# EAGLE design Pixel-2 (EAGLE 8.3.2)
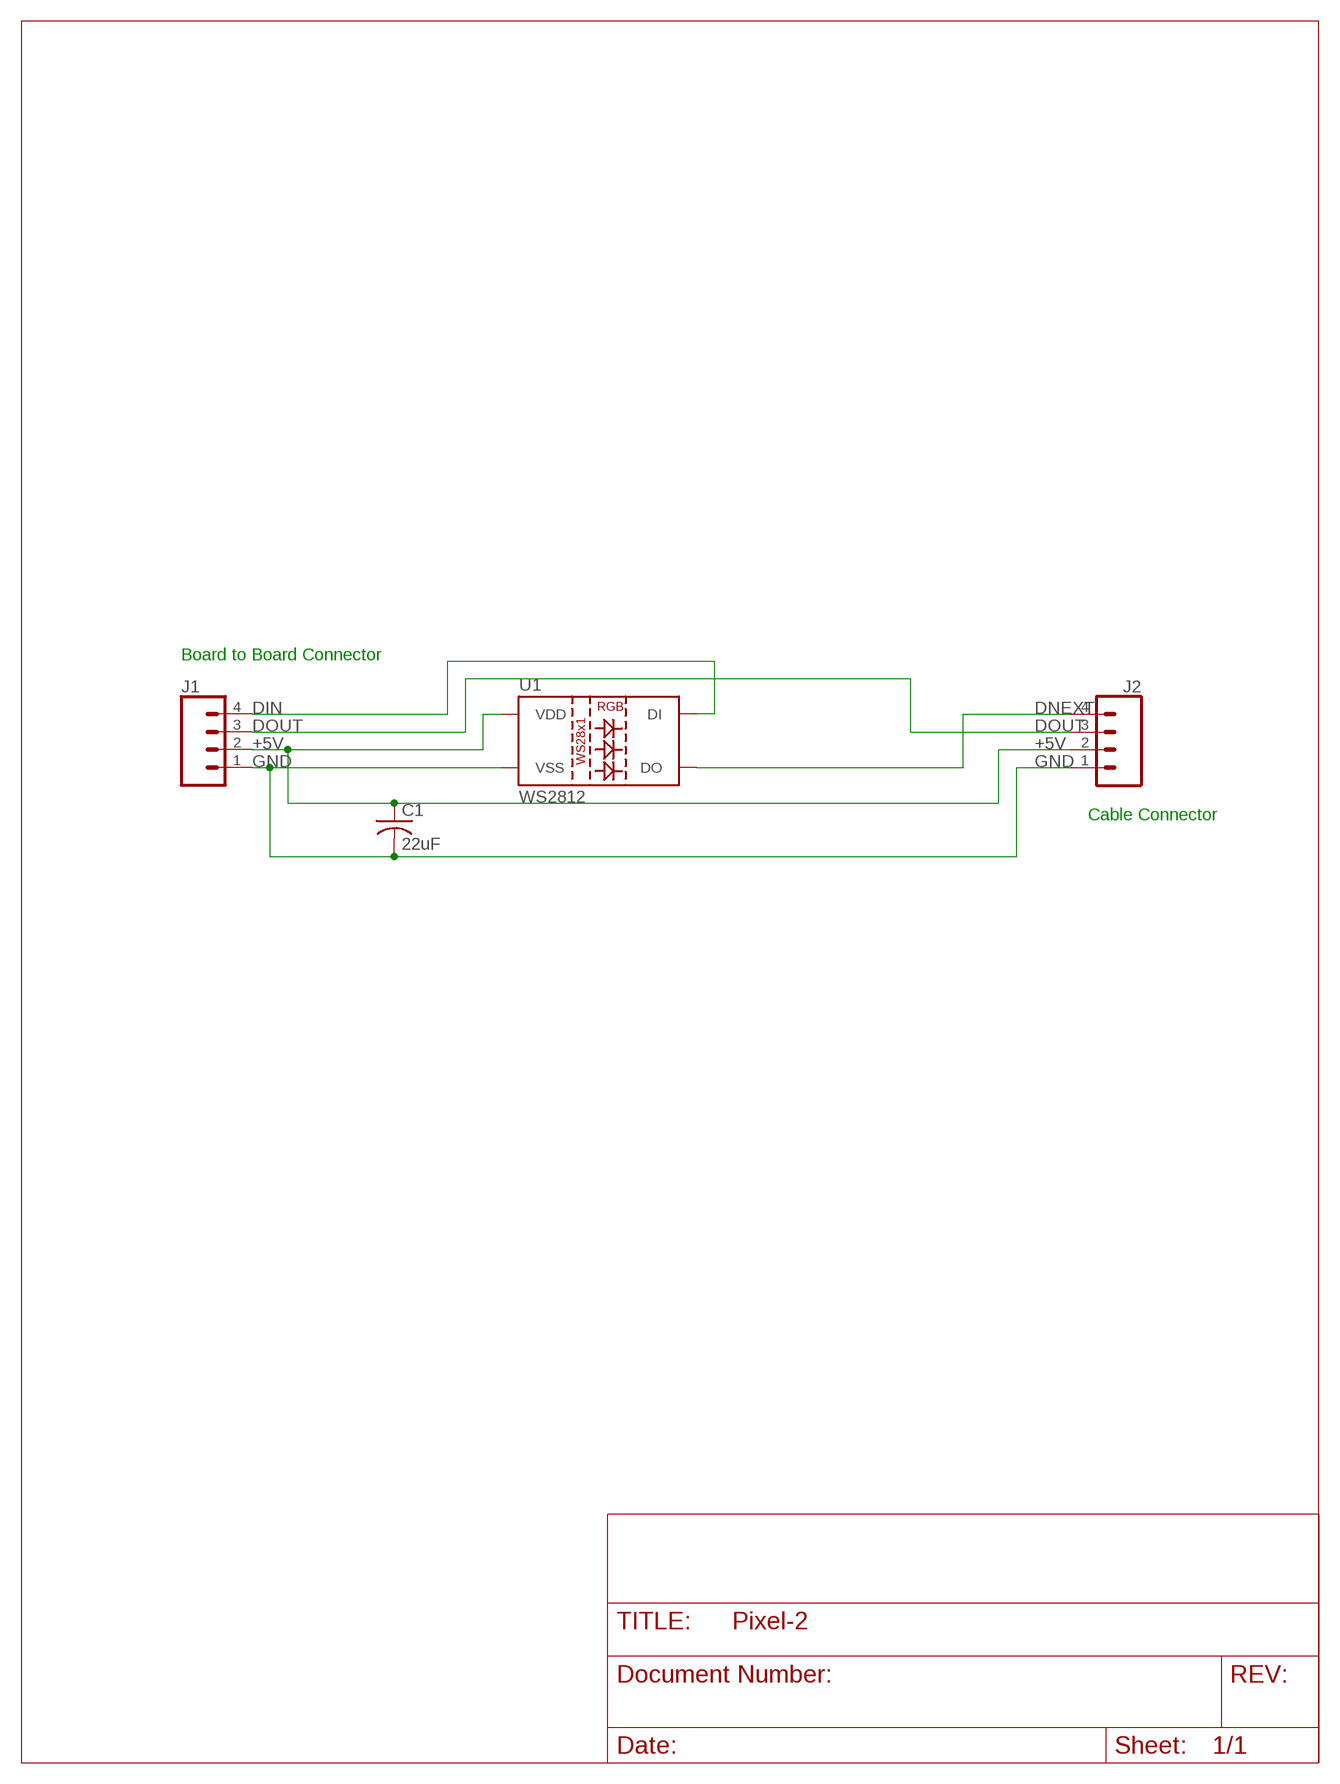
[diagram p0: schematic, sheet 1]

## Parts
C1  22uF  C-USC0402  [C0402]
J1  CONN_04  [1X04]
J2  CONN_04  [1X04]
U1  WS2812  WS2812"  [LED-TRICOLOR-5050-IC]

## Nets
+5V: C1.1 J1.2 J2.2 U1.3(VDD) U1.5(VDD)
DIN: J1.4 U1.2(DI)
DNEXT: J2.4 U1.1(DO)
DOUT: J1.3 J2.3
GND: C1.2 J1.1 J2.1 U1.6(VSS)

## Notes on the sheet
- Board to Board Connector
- Cable Connector

## Library data of the parts
C1 = adafruit:C-US: CAPACITOR, American symbol
J1 J2 = SparkFun-Connectors:CONN_04: Multi connection point. Often used as Generic Header-pin footprint for 0.1 inch spaced/style header connections On any of the 0.1 inch spaced packages, you can populate with these: Break Away Headers - Straight <https://www.sparkfun.com/products/116> (PRT-00116) Break Away Male Headers - Right Angle <https://www.sparkfun.com/products/553> (PRT-00553) Female Headers <https://www.sparkfun.com/products/115> (PRT-00115) Break Away Headers - Machine Pin <https://www.sparkfun.com/products/117> (PRT-00117) Break Away Female Headers - Swiss Machine Pin <https://www.sparkfun.com/products/743> (PRT-00743) For SCREWTERMINALS and SPRING TERMINALS visit here: Screw Terimnals on SparkFun.com <https://www.sparkfun.com/search/results?term=Screw+Terminals> (5mm/3.5mm/2.54mm spacing) This device is also useful as a general connection point to wire up your design to another part of your project. Our various solder wires solder well into these plated through hole pads. Hook-Up Wire - Assortment (Stranded, 22 AWG) <https://www.sparkfun.com/products/11375> (PRT-11375) Hook-Up Wire - Assortment (Solid Core, 22 AWG) <https://www.sparkfun.com/products/11367> (PRT-11367) View the entire wire category on our website here <https://www.sparkfun.com/categories/141> Special notes: Molex polarized connector foot print use with SKU : PRT-08231 with associated crimp pins and housings. 1MM SMD Version SKU: PRT-10208; PROD_ID: CONN-09696
U1 = SparkFun-LED:WS2812: WS2812 RGB LED w/ WS2811 driver 5x5mm SMD LED with built-in controller IC. Color: Red/Green/Blue mC Rating: RGB: 550, 1100, 200 mcd Current:RGB: 20, 20, 20 mA Forward Voltage: RGB: 1.8, 3.0, 3.2 V Packages:LED-TRICOLOR-5050-IC SparkFun Products: LED-SMD RGB (WS2812) <https://www.sparkfun.com/products/11821>; PROD_ID: DIO-11598

## Board
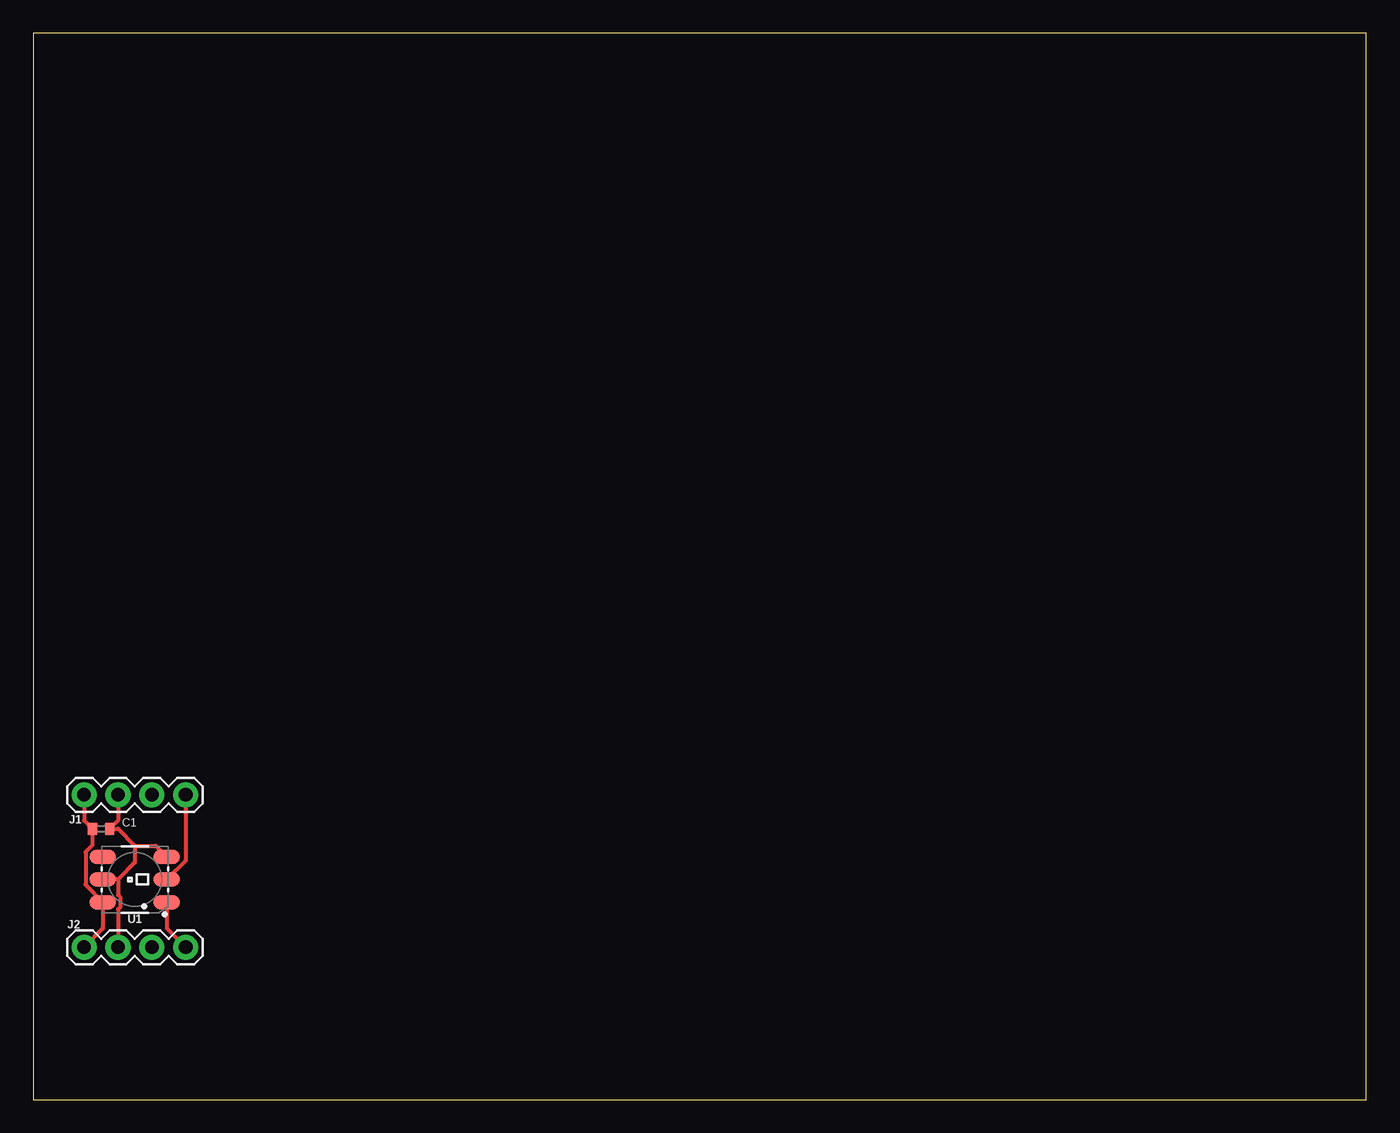
[diagram p1: board, top side]
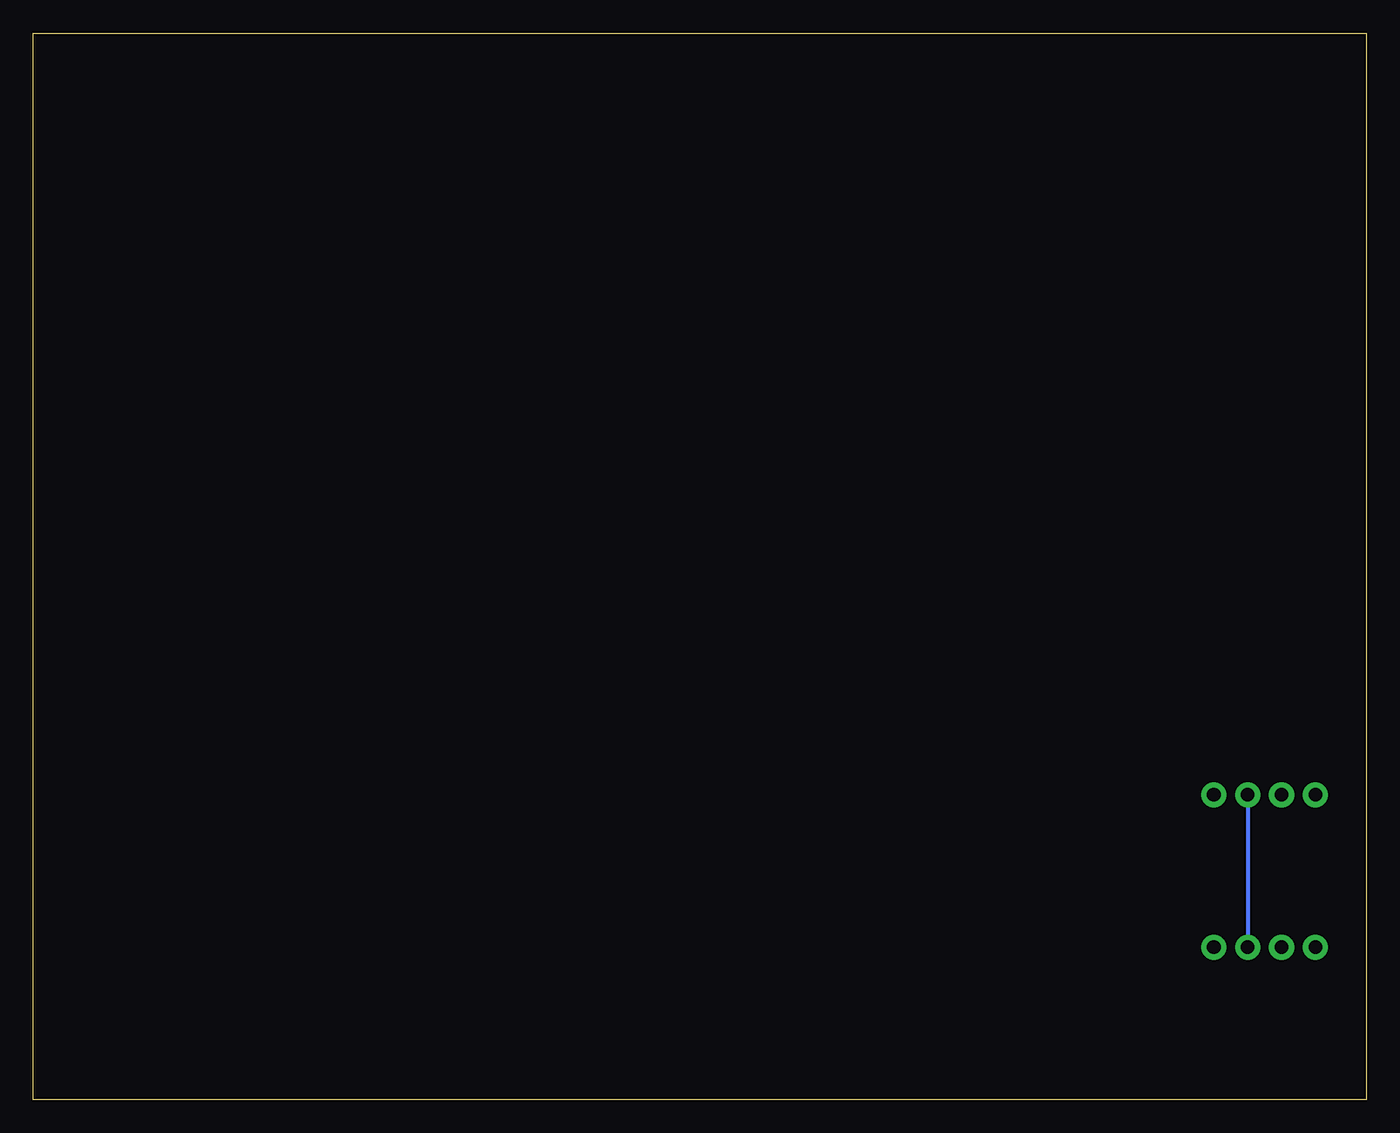
[diagram p2: board, bottom side, seen from below]

Size 100 x 80 mm. Coordinates in mm from the lower left corner, seen from the top.
Outline: 0,0 100,0 100,80 0,80 0,0
Copper layers (1*16): Top 0.035mm / dielectric 1.5mm / Bottom 0.035mm
Design rules "default": minimum track width 6mil, minimum drill 0.35mm, track to track 6mil, track to pad 6mil, pad to pad 6mil, via to via 6mil, smd to smd 6mil, copper to edge 40mil, drill to drill 6mil, minimum pad ring 10mil, minimum via ring 8mil, stop-mask expansion 4mil, vias tented up to drill 0mil, thermal gap 10mil

### Footprints (pad centres in the part's own frame; a part is rotated, then mirrored left to right if it is on the bottom)
C0402 = smd 0.7 x 0.9: 1 -0.65,0; 2 0.65,0
1X04 = drill 1.016 pad 1.88: 1 0,0; 2 2.54,0; 3 5.08,0; 4 7.62,0
LED-TRICOLOR-5050-IC = smd 2 x 1.1: 1 -2.4,1.7; 2 -2.4,0; 3 -2.4,-1.7; 4 2.4,-1.7; 5 2.4,0; 6 2.4,1.7

### Placement (x,y rotation side)
C1  5.08,20.32 180 top
J1  3.81,22.86 0 top
J2  3.81,11.43 0 top
U1  7.62,16.51 180 top

### Tracks (layer width: path | path; a pad name or v marks a point on that pad's centre or on a via)
+5V
  Top 0.305: J1.2 6.35,20.94 C1.1 6.35,20.32 7.62,19.05 | 7.62,19.05 9.18,19.05 U1.3 | 7.62,19.05 7.62,17.78 6.35,16.51 | 6.35,16.51 U1.5 | 6.35,16.51 6.35,15.34 6.53,15.16 6.53,14.46 6.35,14.28 J2.2
DIN
  Top 0.305: J1.4 11.43,17.92 U1.2
DNEXT
  Top 0.305: U1.1 10.02,12.84 J2.4
DOUT
  Bottom 0.305: J1.3 J2.3
GND
  Top 0.305: J1.1 3.81,20.94 C1.2 4.43,19.08 3.92,18.56 3.92,16.11 U1.6 5.22,12.84 J2.1